# EasyEDA Pro project PCB_keyboard_V1_3_1.eprj

# Schematic PCB_keyboard
Board Name: PCB_keyboard; Create Date: 2025-06-30; Page Name: Sheet_1; Project Name: PCB_keyboard_V1.3; Schematic Name: PCB_keyboard; Update Date: 2025-06-30; Add into BOM: yes; Company: Your Company; Convert to PCB: yes; Date: 2025-05-16; REV: 1.0; Sheet: 1/1; spicePre: .
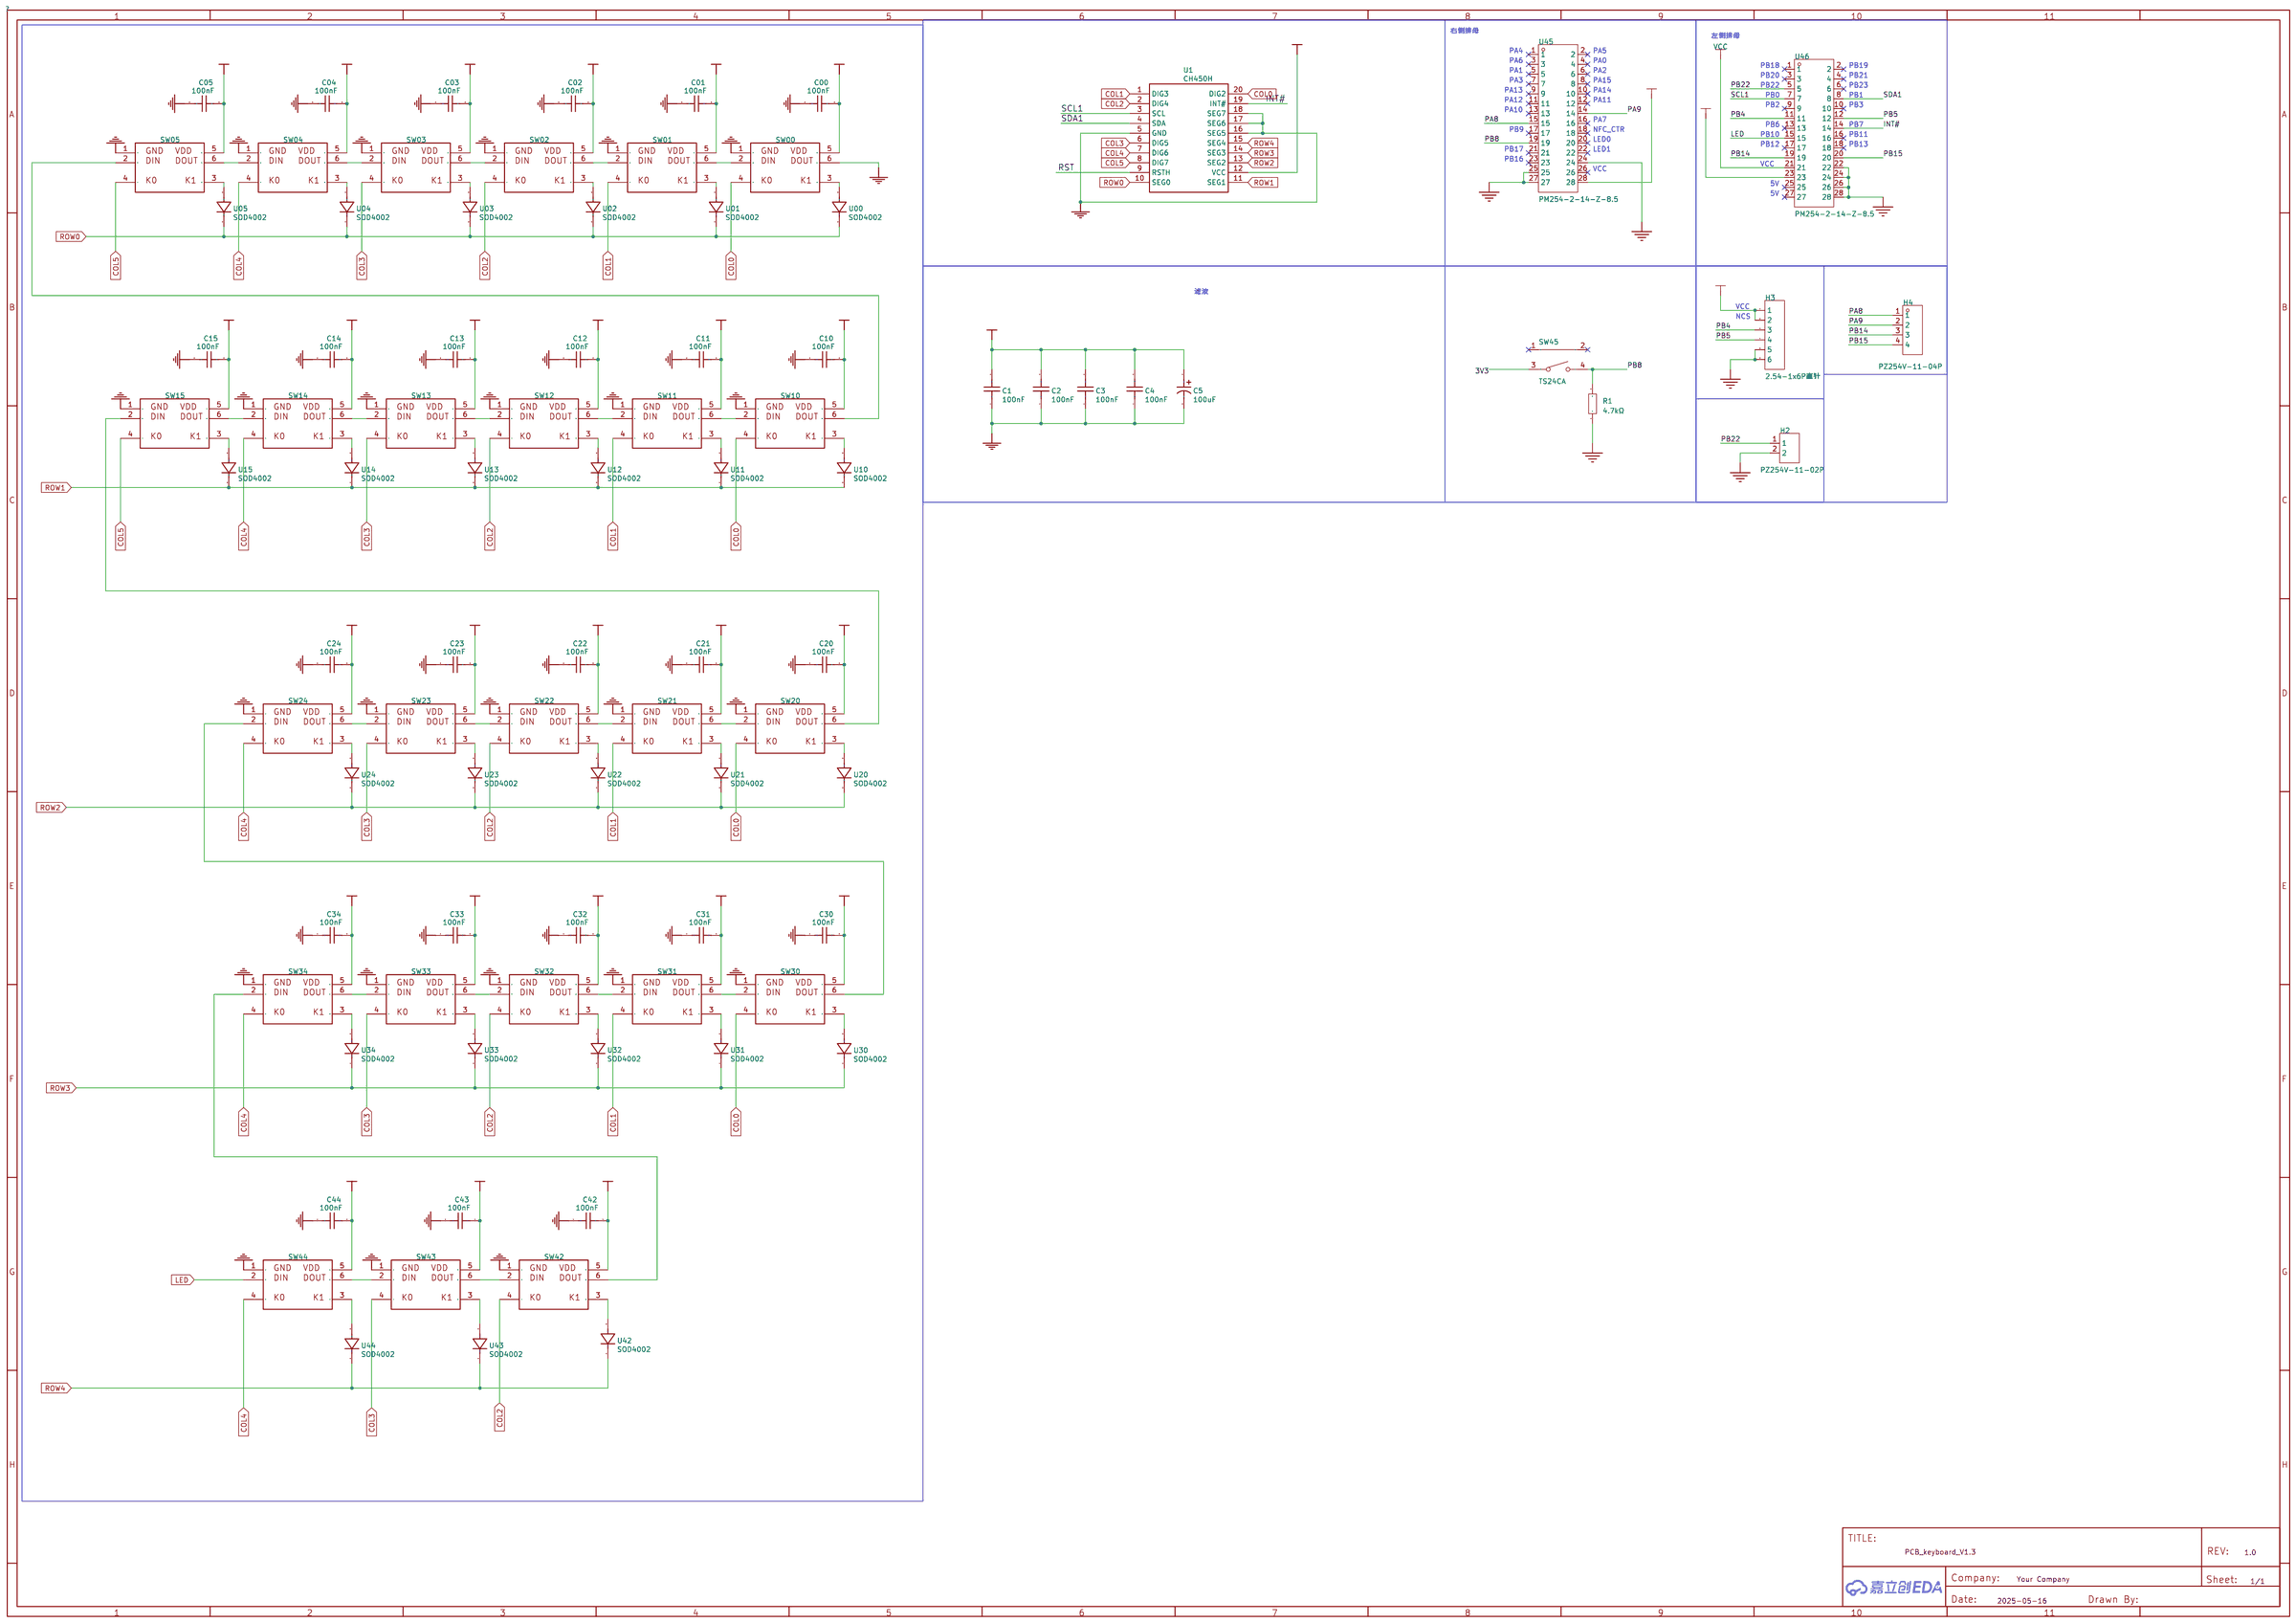
[diagram p0: schematic sheet]

## Parts
C00  100nF  [C0603]
C01  100nF  [C0603]
C1  100nF  [C0603]
C02  100nF  [C0603]
C2  100nF  [C0603]
C03  100nF  [C0603]
C3  100nF  [C0603]
C04  100nF  [C0603]
C4  100nF  [C0603]
C05  100nF  [C0603]
C5  100uF  [CAP-TH_BD6.0-P2.50-D0.5-FD]
C10  100nF  [C0603]
C11  100nF  [C0603]
C12  100nF  [C0603]
C13  100nF  [C0603]
C14  100nF  [C0603]
C15  100nF  [C0603]
C20  100nF  [C0603]
C21  100nF  [C0603]
C22  100nF  [C0603]
C23  100nF  [C0603]
C24  100nF  [C0603]
C30  100nF  [C0603]
C31  100nF  [C0603]
C32  100nF  [C0603]
C33  100nF  [C0603]
C34  100nF  [C0603]
C42  100nF  [C0603]
C43  100nF  [C0603]
C44  100nF  [C0603]
H2  PZ254V-11-02P  [HDR-TH_2P-P2.54-V-M]
H3  2.54-1x6P直针  [HDR-TH_6P-P2.54-V-M-1]
H4  PZ254V-11-04P  [HDR-TH_4P-P2.54-V-M]
R1  4.7kΩ  [R0805]
SW00  凯华轴座+3528反贴灯 COPY  [凯华轴座+3528反贴灯]
SW01  凯华轴座+3528反贴灯 COPY  [凯华轴座+3528反贴灯]
SW02  凯华轴座+3528反贴灯 COPY  [凯华轴座+3528反贴灯]
SW03  凯华轴座+3528反贴灯 COPY  [凯华轴座+3528反贴灯]
SW04  凯华轴座+3528反贴灯 COPY  [凯华轴座+3528反贴灯]
SW05  凯华轴座+3528反贴灯 COPY  [凯华轴座+3528反贴灯]
SW10  凯华轴座+3528反贴灯 COPY  [凯华轴座+3528反贴灯]
SW11  凯华轴座+3528反贴灯 COPY  [凯华轴座+3528反贴灯]
SW12  凯华轴座+3528反贴灯 COPY  [凯华轴座+3528反贴灯]
SW13  凯华轴座+3528反贴灯 COPY  [凯华轴座+3528反贴灯]
SW14  凯华轴座+3528反贴灯 COPY  [凯华轴座+3528反贴灯]
SW15  凯华轴座+3528反贴灯 COPY  [凯华轴座+3528反贴灯]
SW20  凯华轴座+3528反贴灯 COPY  [凯华轴座+3528反贴灯]
SW21  凯华轴座+3528反贴灯 COPY  [凯华轴座+3528反贴灯]
SW22  凯华轴座+3528反贴灯 COPY  [凯华轴座+3528反贴灯]
SW23  凯华轴座+3528反贴灯 COPY  [凯华轴座+3528反贴灯]
SW24  凯华轴座+3528反贴灯 COPY  [凯华轴座+3528反贴灯]
SW30  凯华轴座+3528反贴灯 COPY  [凯华轴座+3528反贴灯]
SW31  凯华轴座+3528反贴灯 COPY  [凯华轴座+3528反贴灯]
SW32  凯华轴座+3528反贴灯 COPY  [凯华轴座+3528反贴灯]
SW33  凯华轴座+3528反贴灯 COPY  [凯华轴座+3528反贴灯]
SW34  凯华轴座+3528反贴灯 COPY  [凯华轴座+3528反贴灯]
SW42  凯华轴座+3528反贴灯 COPY  [凯华轴座+3528反贴灯]
SW43  凯华轴座+3528反贴灯 COPY  [凯华轴座+3528反贴灯]
SW44  凯华轴座+3528反贴灯 COPY  [凯华轴座+3528反贴灯]
SW45  TS24CA  [SW-SMD_TS24CA]
U00  SOD4002  [SOD-123FL_L2.8-W1.8-LS3.8-R-RD]
U1  CH450H  [SOP-20_L12.7-W7.5-P1.27-LS10.3-BL]
U01  SOD4002  [SOD-123FL_L2.8-W1.8-LS3.8-R-RD]
U02  SOD4002  [SOD-123FL_L2.8-W1.8-LS3.8-R-RD]
U03  SOD4002  [SOD-123FL_L2.8-W1.8-LS3.8-R-RD]
U04  SOD4002  [SOD-123FL_L2.8-W1.8-LS3.8-R-RD]
U05  SOD4002  [SOD-123FL_L2.8-W1.8-LS3.8-R-RD]
U10  SOD4002  [SOD-123FL_L2.8-W1.8-LS3.8-R-RD]
U11  SOD4002  [SOD-123FL_L2.8-W1.8-LS3.8-R-RD]
U12  SOD4002  [SOD-123FL_L2.8-W1.8-LS3.8-R-RD]
U13  SOD4002  [SOD-123FL_L2.8-W1.8-LS3.8-R-RD]
U14  SOD4002  [SOD-123FL_L2.8-W1.8-LS3.8-R-RD]
U15  SOD4002  [SOD-123FL_L2.8-W1.8-LS3.8-R-RD]
U20  SOD4002  [SOD-123FL_L2.8-W1.8-LS3.8-R-RD]
U21  SOD4002  [SOD-123FL_L2.8-W1.8-LS3.8-R-RD]
U22  SOD4002  [SOD-123FL_L2.8-W1.8-LS3.8-R-RD]
U23  SOD4002  [SOD-123FL_L2.8-W1.8-LS3.8-R-RD]
U24  SOD4002  [SOD-123FL_L2.8-W1.8-LS3.8-R-RD]
U30  SOD4002  [SOD-123FL_L2.8-W1.8-LS3.8-R-RD]
U31  SOD4002  [SOD-123FL_L2.8-W1.8-LS3.8-R-RD]
U32  SOD4002  [SOD-123FL_L2.8-W1.8-LS3.8-R-RD]
U33  SOD4002  [SOD-123FL_L2.8-W1.8-LS3.8-R-RD]
U34  SOD4002  [SOD-123FL_L2.8-W1.8-LS3.8-R-RD]
U42  SOD4002  [SOD-123FL_L2.8-W1.8-LS3.8-R-RD]
U43  SOD4002  [SOD-123FL_L2.8-W1.8-LS3.8-R-RD]
U44  SOD4002  [SOD-123FL_L2.8-W1.8-LS3.8-R-RD]
U45  PM254-2-14-Z-8.5  [HDR-TH_28P-P2.54-V-F-R2-C14-S2.54-1]
U46  PM254-2-14-Z-8.5  [HDR-TH_28P-P2.54-V-F-R2-C14-S2.54-1]

## Library data of the parts
C00 C01 C1 C02 C2 C03 C3 C04 C4 C05 C10-C15 C20-C24 C30-C34 C42-C44 = 100nF: Supplier: LCSC; Supplier Part: C6119867; Manufacturer: HRE(芯声); Manufacturer Part: CGA0603X7R104K500JT; JLCPCB Part Class: Extended Part; nameAlias: Value; Contributor: lcsc; spicePre: C; spiceSymbolName: CGA0603X7R104K500JT
C5 = 100uF: Supplier: LCSC; Supplier Part: C2873969; Manufacturer: ROQANG(容强); Manufacturer Part: KM1E101M0611; link: https://so.szlcsc.com/global.html?k=C2873969&ref=editor; nameAlias: Value; Contributor: lcsc; spicePre: C; spiceSymbolName: KM1E101M0611
H2 = PZ254V-11-02P: 插针结构:1x2P;间距:2.54mm;行距:-;圆针/方针:方针;安装方式:直插;排数:单排;总PIN位数:2P;额定电流:-;额定电压:-;配合针长度:6mm;塑高:2.5mm;端接针长度:3mm;触头材质:黄铜;触头镀层:-;工作温度:-40℃~+105℃;颜色:黑色;; LCSC Part Name: 1x2P 间距:2.54mm 方针 直插; Supplier Part: C492401; Manufacturer: XFCN(兴飞); Supplier Footprint: 插件,P=2.54mm; JLCPCB Part Class: 扩展库; Datasheet: https://atta.szlcsc.com/upload/public/pdf/source/20200309/C492401_A812433581A9B211A7FFA413ADDFF0E5.pdf; Supplier: LCSC; Pin Structure: 1x2P; Pitch: 2.54mm; Circluar Pins/Square Pins: 方针; Mounting Type: 直插; Number of Rows: 单排; Number of Pins: 2P; Length of Mating Pin: 6mm; Insulation Height: 2.5mm; Length of End Connection Pin: 3mm; Contact Material: 黄铜; Operating Temperature: -40℃~+105℃; Color: 黑色
H3 = 2.54-1x6P直针: 插针结构:1x6P;间距:2.54mm;行距:-;圆针/方针:方针;安装方式:直插;排数:单排;总PIN位数:6P;额定电流:3A;额定电压:-;配合针长度:-;塑高:-;触头材质:黄铜;触头镀层:-;工作温度:-40℃~+105℃;颜色:黑色;; LCSC Part Name: 1x6P 间距:2.54mm 方针 直插; Supplier Part: C37208; Manufacturer: BOOMELE(博穆精密); Supplier Footprint: 插件,P=2.54mm; JLCPCB Part Class: 扩展库; Datasheet: https://atta.szlcsc.com/upload/public/pdf/source/20250115/42A019761A40C8B839643401D8CA5A96.pdf; Supplier: LCSC; Pin Structure: 1x6P; Pitch: 2.54mm; Circluar Pins/Square Pins: 方针; Mounting Type: 直插; Number of Rows: 单排; Number of Pins: 6P; Current Rating: 3A; Contact Material: 黄铜; Operating Temperature: -40℃~+105℃; Color: 黑色
H4 = PZ254V-11-04P: 插针结构:1x4P;间距:2.54mm;行距:-;圆针/方针:方针;安装类型:直插;排数:单排;总PIN位数:4P;额定电流:3A;额定电压:250V;配合针长度:6mm;塑高:2.5mm;端接针长度:3mm;触头材质:-;工作温度范围:-40℃~+105℃;颜色:黑色;; LCSC Part Name: 间距:2.54mm 1x4P 直插 方针; Supplier Part: C2691448; Manufacturer: XFCN(兴飞); Supplier Footprint: 插件,P=2.54mm; JLCPCB Part Class: 扩展库; Datasheet: https://atta.szlcsc.com/upload/public/pdf/source/20200309/C492403_F9F19131791D08044AD4F84F8E751A34.pdf; Supplier: LCSC; Pin Structure: 1x4P; Pitch: 2.54mm; Circluar Pins/Square Pins: 方针; Mounting Type: 直插; Number of Rows: 单排; Number of Pins: 4P; Current Rating (Max): 3A; Voltage Rating (Max): 250V; Length of Mating Pin: 6mm; Insulation Height: 2.5mm; Length of End Connection Pin: 3mm; Operating Temperature Range: -40℃~+105℃; Color: 黑色
R1 = 0805W8F4701T5E: 电阻类型:厚膜电阻;阻值:4.7kΩ;精度:±1%;功率:125mW;最大工作电压:150V;温度系数:±100ppm/℃;; LCSC Part Name: 4.7kΩ ±1% 125mW 厚膜电阻; Supplier Part: C17673; Manufacturer: UNI-ROYAL(厚声); Supplier Footprint: 0805; JLCPCB Part Class: 基础库; Datasheet: https://atta.szlcsc.com/upload/public/pdf/source/20200306/C422600_1E6D84923E4A46A82E41ADD87F860B5C.pdf; Supplier: LCSC; Type: 厚膜电阻; Tolerance: ±1%; Power(Watts): 125mW; Overload Voltage (Max): 150V; Temperature Coefficient: ±100ppm/℃; Operating Temperature Range: -55℃~+155℃
SW00 SW01 SW02 SW03 SW04 SW05 SW10-SW15 SW20-SW24 SW30-SW34 SW42-SW44 = 凯华轴座+3528反贴灯 COPY
SW45 = TS24CA: 电路结构:单刀单掷;按钮形状:矩形按钮;安装方式:卧贴;开关长度:4.55mm;开关宽度:1.8mm;开关高度:3.5mm;触点电流:50mA;额定电压(DC):12V;带灯:-;机械寿命:-;; LCSC Part Name: 4.55*1.8*3.5mm 卧贴 轻触开关; Supplier Part: C393942; Manufacturer: SHOU HAN(首韩); Supplier Footprint: SMD; JLCPCB Part Class: 扩展库; Datasheet: https://atta.szlcsc.com/upload/public/pdf/source/20190521/C393942_591A9E318887EFA4274D34029981AD99.pdf; Supplier: LCSC; Circuit: 单刀单掷; Actuator Style: 矩形按钮; Mounting Style: 卧贴; Switch Length: 4.55mm; Switch Width: 1.8mm; Switch Height: 3.5mm; Contact Current: 50mA; Voltage Rating (DC): 12V
U00 U01 U02 U03 U04 U05 U10-U15 U20-U24 U30-U34 U42-U44 = SOD4002: Supplier: LCSC; Supplier Part: C2994252; Manufacturer: MDD(辰达半导体); JLCPCB Part Class: Extended Part; link: https://so.szlcsc.com/global.html?k=C2994252&ref=editor; Contributor: lcsc; spicePre: U
U1 = CH450H: Supplier: LCSC; Manufacturer: WCH(南京沁恒); Supplier Part: C56245; JLCPCB Part Class: Extended Part; spicePre: U
U45 U46 = PM254-2-14-Z-8.5: 插孔结构:2x14P;间距:2.54mm;行距:2.54mm;圆孔/方孔:方孔;安装类型:直插;排数:双排;总孔位数:28P;额定电流:3A;额定电压:-;插孔方向:顶部;塑高:8.5mm;触头材质:铜合金;工作温度范围:-40℃~+105℃;焊接温度(最大值):260℃@5S;; LCSC Part Name: 2x14P 间距:2.54mm 直插; Supplier Part: C2897415; Manufacturer: HCTL(华灿天禄); Supplier Footprint: 插件,P=2.54mm; JLCPCB Part Class: 扩展库; Datasheet: https://atta.szlcsc.com/upload/public/pdf/source/20230609/3D36CA2C1BFC9FD1C3F709AD9DFEB9C2.pdf; Supplier: LCSC; Holes Structure: 2x14P; Pitch: 2.54mm; Row Spacing: 2.54mm; Circular Hole / Square Hole: 方孔; Mounting Type: 直插; Number of Rows: 双排; Number of Holes: 28P; Current Rating (Max): 3A; Holes Direction: 顶部; Insulation Height: 8.5mm; Contact Material: 铜合金; Operating Temperature Range: -40℃~+105℃; Soldering Temperature(Max): 260℃@5S

## Nets
3V3: H3.1 H3.2 SW45.3 U45.28 U46.23
GND: C00.1 C01.1 C1.1 C02.1 C2.1 C03.1 C3.1 C04.1 C4.1 C05.1 C5.2 C10.1 C11.1 C12.1 C13.1 C14.1 C15.1 C20.1 C21.1 C22.1 C23.1 C24.1 C30.1 C31.1 C32.1 C33.1 C34.1 C42.1 C43.1 C44.1 H2.2 H3.5 H3.6 R1.1 SW00.1 SW00.6 SW01.1 SW02.1 SW03.1 SW04.1 SW05.1 SW10.1 SW11.1 SW12.1 SW13.1 SW14.1 SW15.1 SW20.1 SW21.1 SW22.1 SW23.1 SW24.1 SW30.1 SW31.1 SW32.1 SW33.1 SW34.1 SW42.1 SW43.1 SW44.1 U1.5(GND) U1.16(SEG5) U1.17(SEG6) U1.18(SEG7) U45.24 U45.25 U45.27 U46.22 U46.24 U46.26 U46.28
VCC: C00.2 C01.2 C1.2 C02.2 C2.2 C03.2 C3.2 C04.2 C4.2 C5.1 C05.2 C10.2 C11.2 C12.2 C13.2 C14.2 C15.2 C20.2 C21.2 C22.2 C23.2 C24.2 C30.2 C31.2 C32.2 C33.2 C34.2 C42.2 C43.2 C44.2 SW00.5 SW01.5 SW02.5 SW03.5 SW04.5 SW05.5 SW10.5 SW11.5 SW12.5 SW13.5 SW14.5 SW15.5 SW20.5 SW21.5 SW22.5 SW23.5 SW24.5 SW30.5 SW31.5 SW32.5 SW33.5 SW34.5 SW42.5 SW43.5 SW44.5 U1.12(VCC) U46.21
COL0: SW00.4 SW10.4 SW20.4 SW30.4 U1.20(DIG2)
COL1: SW01.4 SW11.4 SW21.4 SW31.4 U1.1(DIG3)
COL2: SW02.4 SW12.4 SW22.4 SW32.4 SW42.4 U1.2(DIG4)
COL3: SW03.4 SW13.4 SW23.4 SW33.4 SW43.4 U1.6(DIG5)
COL4: SW04.4 SW14.4 SW24.4 SW34.4 SW44.4 U1.7(DIG6)
COL5: SW05.4 SW15.4 U1.8(DIG7)
INT#: U1.19(INT#) U46.14
LED: SW44.2 U46.15
PA8: H4.1 U45.15
PA9: H4.2 U45.14
PB4: H3.3 U46.11
PB5: H3.4 U46.12
PB8: R1.2 SW45.4 U45.19
PB14: H4.3 U46.19
PB15: H4.4 U46.20
PB22: H2.1 U46.5
ROW0: U00.1(K) U01.1(K) U1.10(SEG0) U02.1(K) U03.1(K) U04.1(K) U05.1(K)
ROW1: U1.11(SEG1) U10.1(K) U11.1(K) U12.1(K) U13.1(K) U14.1(K) U15.1(K)
ROW2: U1.13(SEG2) U20.1(K) U21.1(K) U22.1(K) U23.1(K) U24.1(K)
ROW3: U1.14(SEG3) U30.1(K) U31.1(K) U32.1(K) U33.1(K) U34.1(K)
ROW4: U1.15(SEG4) U42.1(K) U43.1(K) U44.1(K)
RST: U1.9(RSTH)
SCL1: U1.3(SCL) U46.7
SDA1: U1.4(SDA) U46.8
$1N69: SW00.3 U00.2(A)
$1N70: SW01.3 U01.2(A)
$1N71: SW02.3 U02.2(A)
$1N72: SW03.3 U03.2(A)
$1N73: SW04.3 U04.2(A)
$1N74: SW05.3 U05.2(A)
$1N77: SW10.3 U10.2(A)
$1N78: SW11.3 U11.2(A)
$1N79: SW12.3 U12.2(A)
$1N80: SW13.3 U13.2(A)
$1N81: SW14.3 U14.2(A)
$1N82: SW15.3 U15.2(A)
$1N83: SW20.3 U20.2(A)
$1N84: SW21.3 U21.2(A)
$1N85: SW22.3 U22.2(A)
$1N86: SW23.3 U23.2(A)
$1N87: SW24.3 U24.2(A)
$1N90: SW30.3 U30.2(A)
$1N91: SW31.3 U31.2(A)
$1N92: SW32.3 U32.2(A)
$1N95: SW33.3 U33.2(A)
$1N97: SW34.3 U34.2(A)
$1N99: SW42.3 U42.2(A)
$1N100: SW43.3 U43.2(A)
$1N101: SW44.3 U44.2(A)
$1N102: SW42.2 SW43.6
$1N103: SW43.2 SW44.6
$1N108: SW34.2 SW42.6
$1N109: SW33.2 SW34.6
$1N110: SW32.2 SW33.6
$1N111: SW31.2 SW32.6
$1N112: SW30.2 SW31.6
$1N113: SW24.2 SW30.6
$1N114: SW23.2 SW24.6
$1N115: SW22.2 SW23.6
$1N116: SW21.2 SW22.6
$1N117: SW20.2 SW21.6
$1N118: SW15.2 SW20.6
$1N119: SW14.2 SW15.6
$1N120: SW13.2 SW14.6
$1N121: SW12.2 SW13.6
$1N122: SW11.2 SW12.6
$1N123: SW10.2 SW11.6
$1N125: SW04.2 SW05.6
$1N126: SW03.2 SW04.6
$1N127: SW02.2 SW03.6
$1N128: SW01.2 SW02.6
$1N129: SW00.2 SW01.6
$1N130: SW05.2 SW10.6

Not connected (* = marked no-connect by the designer): SW45 1* 2*; U45 1* 2* 3* 4* 5* 6* 7* 8* 9* 10* 11* 12* 13* 16* 17* 18* 20* 21* 22* 23* 26*; U46 1* 2* 3* 4* 6* 9* 10* 13* 16* 17* 18* 25* 27*

## Notes on the sheet
- 右侧排母
- 左侧排母
- PA4
- PA5
- PA6
- PA0
- PB18
- PB19
- PA1
- PA3
- PA15
- PA2
- PB20
- PB21
- PA13
- PA14
- PB22
- PB23
- PA12
- PA11
- PB0
- PB2
- PB1
- PB3
- PA10
- PA7
- PB6
- PB7
- PB9
- LED0
- NFC_CTR
- PB10
- PB11
- PB17
- LED1
- PB12
- PB13
- PB16
- VCC
- VCC
- 5V
- 5V
- 滤波
- VCC
- NCS

# Board PCB_PCB_keyboard
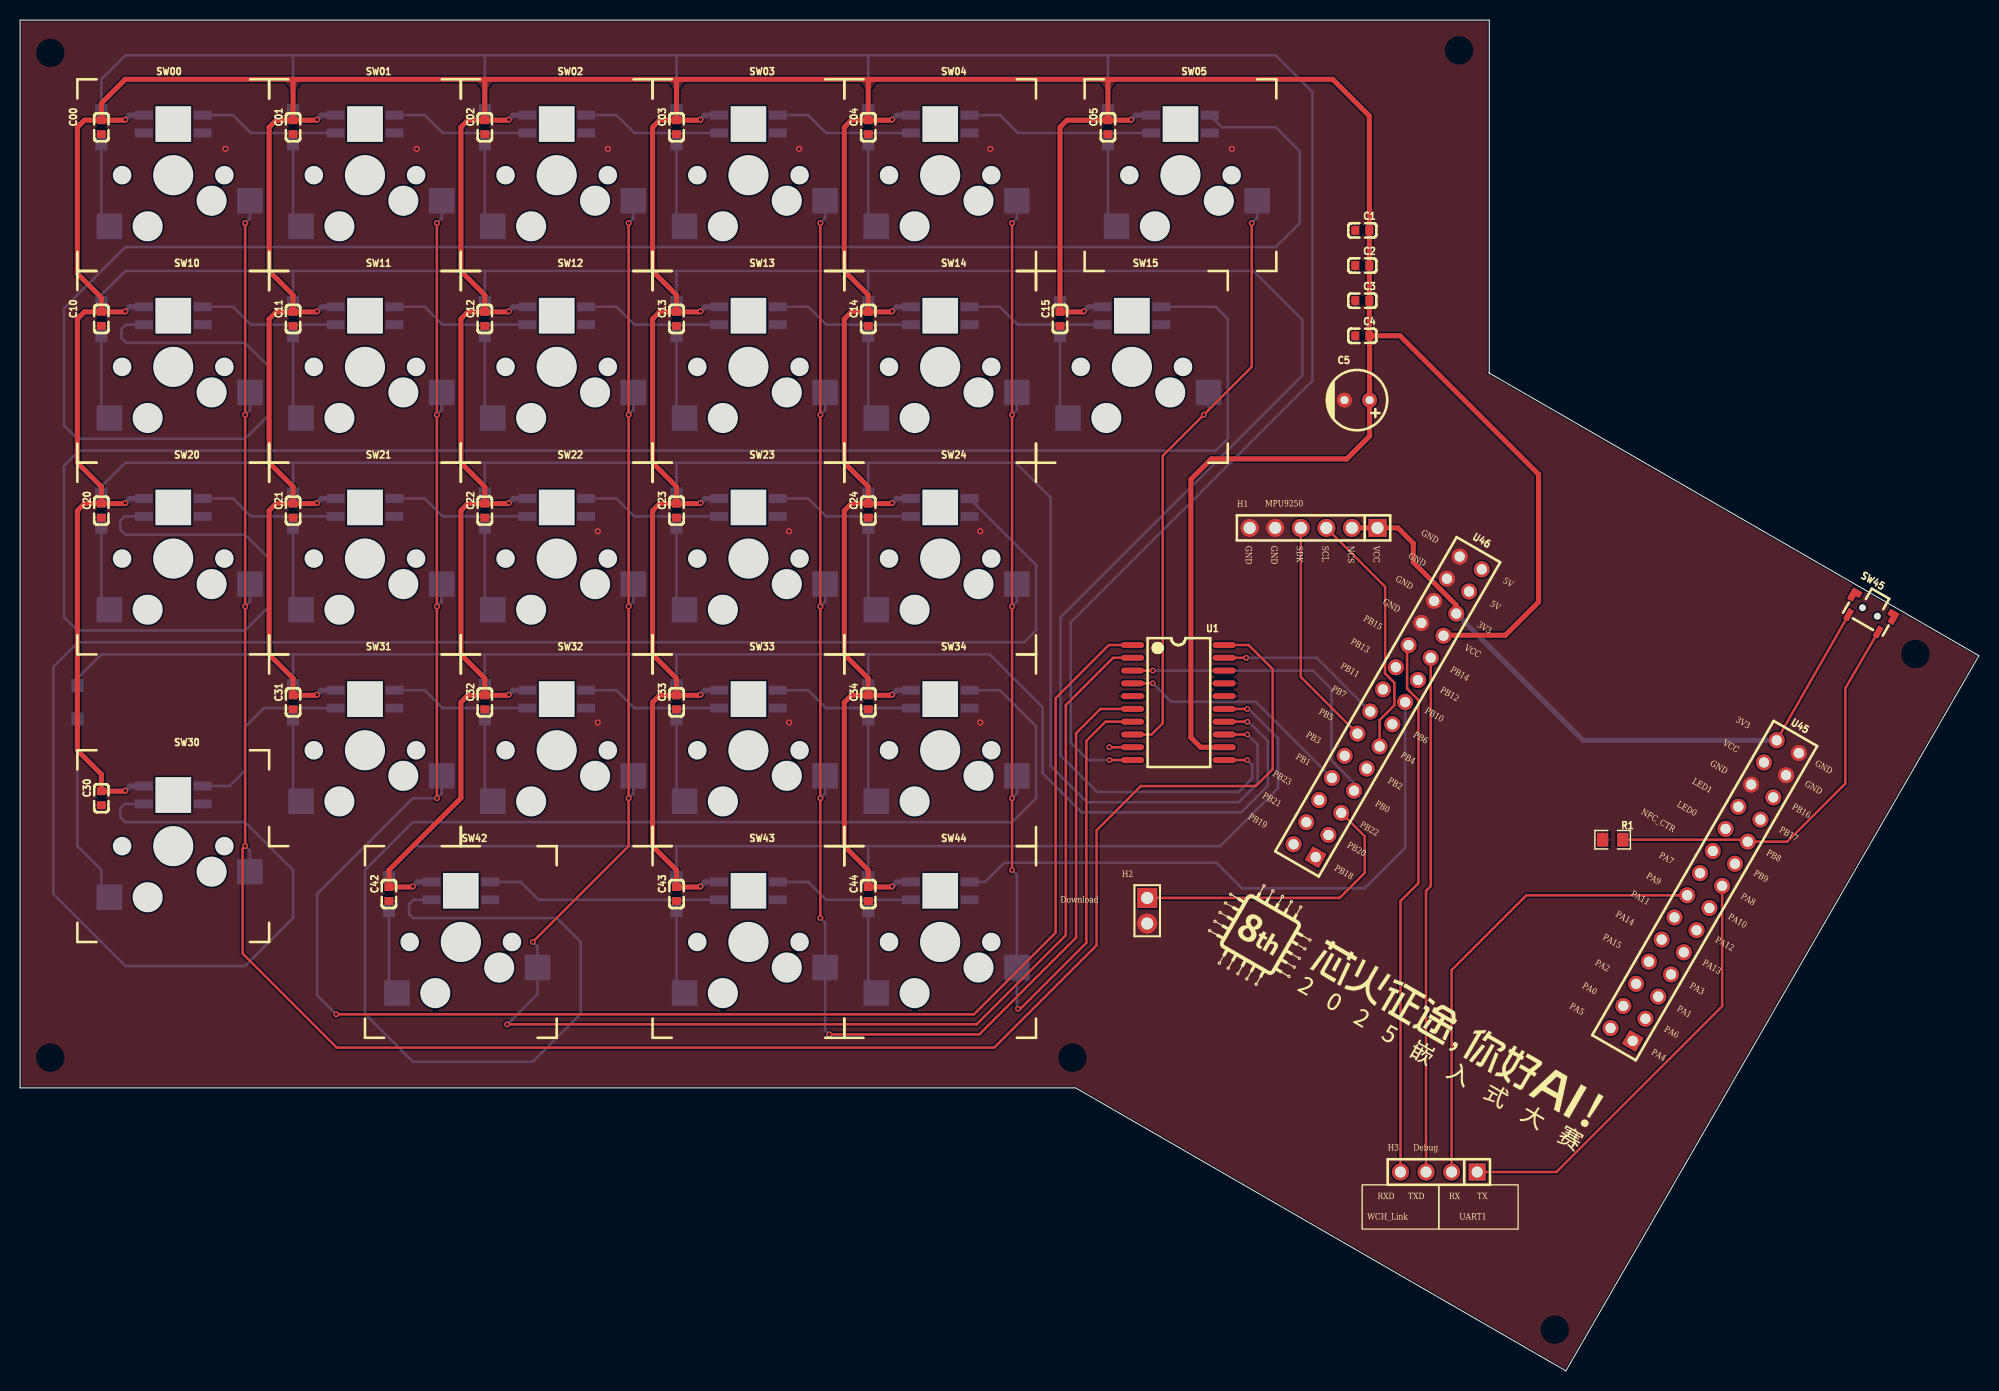
[diagram p1: board, top side]
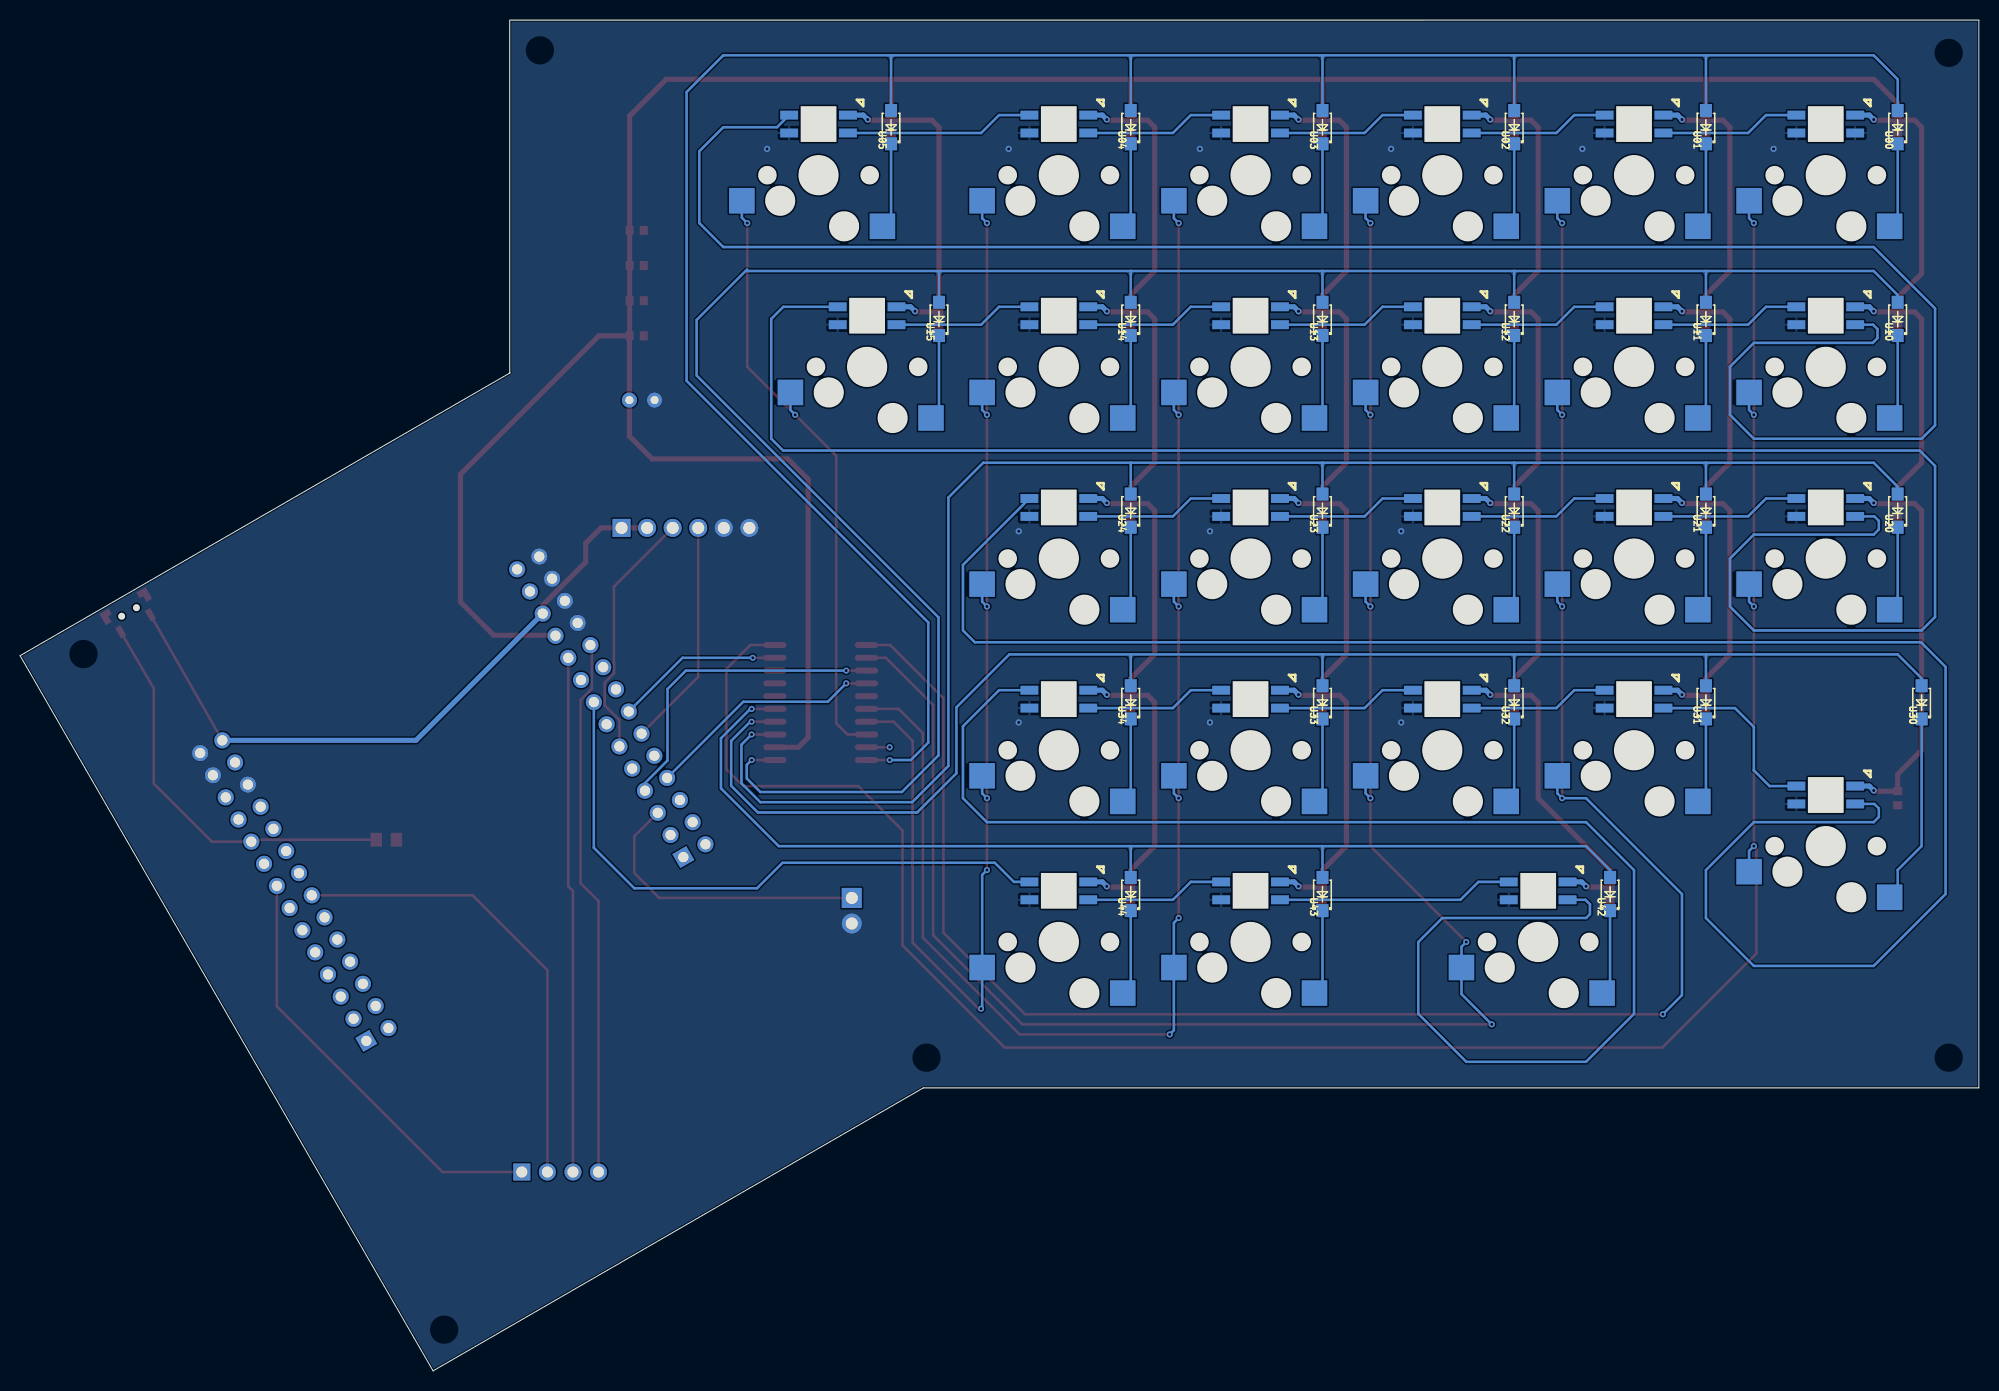
[diagram p2: board, bottom side, seen from below]

Outline 194.62 x 134.23 mm; copper layers: Top Layer, Bottom Layer. Coordinates in mm from the lower left corner of the outline.
Outline path: 145.97,99.15 145.9,99.19 ; 145.97,99.15 145.97,134.23 0,134.23 0,28.12 104.87,28.12 153.58,0 194.62,71.07 145.97,99.15
Stack: Top Layer 0.035mm / Dielectric1 1.51mm FR4 er 4.5 / Bottom Layer 0.035mm

## Design rules (mm)
spacing Default (default): track to track 0.152, other pairs 0 to 0.152
track width Default (default): min 0.254, default 0.254, max 25.4
differential pair differentialPair (default): width min 0.127, default 0.254, max 2.54; gap min 0.152, default 0.152
via Default (default): diameter min 0.61, default 0.61, max 100.025; hole min 0.305, default 0.305, max 59.995

## Placement (name value [footprint] x y rotation side)
C00  100nF  [C0603]  8.07 123.59 90 top
C01  100nF  [C0603]  27.12 123.59 90 top
C1  100nF  [C0603]  133.36 113.34 0 top
C02  100nF  [C0603]  46.17 123.59 90 top
C2  100nF  [C0603]  133.36 109.84 0 top
C03  100nF  [C0603]  65.22 123.59 90 top
C3  100nF  [C0603]  133.36 106.35 0 top
C04  100nF  [C0603]  84.27 123.59 90 top
C4  100nF  [C0603]  133.36 102.86 0 top
C05  100nF  [C0603]  108.08 123.59 90 top
C5  100uF  [CAP-TH_BD6.0-P2.50-D0.5-FD]  132.83 96.47 180 top
C10  100nF  [C0603]  8.07 104.54 90 top
C11  100nF  [C0603]  27.12 104.54 90 top
C12  100nF  [C0603]  46.17 104.54 90 top
C13  100nF  [C0603]  65.22 104.54 90 top
C14  100nF  [C0603]  84.27 104.54 90 top
C15  100nF  [C0603]  103.32 104.54 90 top
C20  100nF  [C0603]  8.07 85.49 90 top
C21  100nF  [C0603]  27.12 85.49 90 top
C22  100nF  [C0603]  46.17 85.49 90 top
C23  100nF  [C0603]  65.22 85.49 90 top
C24  100nF  [C0603]  84.27 85.49 90 top
C30  100nF  [C0603]  8.07 56.91 90 top
C31  100nF  [C0603]  27.12 66.43 90 top
C32  100nF  [C0603]  46.17 66.43 90 top
C33  100nF  [C0603]  65.22 66.43 90 top
C34  100nF  [C0603]  84.27 66.43 90 top
C42  100nF  [C0603]  36.64 47.38 90 top
C43  100nF  [C0603]  65.22 47.38 90 top
C44  100nF  [C0603]  84.27 47.38 90 top
H2  PZ254V-11-02P  [HDR-TH_2P-P2.54-V-M]  111.98 45.73 270 top
H3  2.54-1x6P直针  [HDR-TH_6P-P2.54-V-M-1]  128.51 83.77 180 top
H4  PZ254V-11-04P  [HDR-TH_4P-P2.54-V-M]  140.96 19.76 180 top
R1  4.7kΩ  [R0805]  158.23 52.78 0 top
SW00  凯华轴座+3528反贴灯 COPY  [凯华轴座+3528反贴灯]  15.21 118.82 0 top
SW01  凯华轴座+3528反贴灯 COPY  [凯华轴座+3528反贴灯]  34.26 118.82 0 top
SW02  凯华轴座+3528反贴灯 COPY  [凯华轴座+3528反贴灯]  53.31 118.82 0 top
SW03  凯华轴座+3528反贴灯 COPY  [凯华轴座+3528反贴灯]  72.36 118.82 0 top
SW04  凯华轴座+3528反贴灯 COPY  [凯华轴座+3528反贴灯]  91.41 118.82 0 top
SW05  凯华轴座+3528反贴灯 COPY  [凯华轴座+3528反贴灯]  115.29 118.82 0 top
SW10  凯华轴座+3528反贴灯 COPY  [凯华轴座+3528反贴灯]  15.21 99.77 0 top
SW11  凯华轴座+3528反贴灯 COPY  [凯华轴座+3528反贴灯]  34.26 99.77 0 top
SW12  凯华轴座+3528反贴灯 COPY  [凯华轴座+3528反贴灯]  53.31 99.77 0 top
SW13  凯华轴座+3528反贴灯 COPY  [凯华轴座+3528反贴灯]  72.36 99.77 0 top
SW14  凯华轴座+3528反贴灯 COPY  [凯华轴座+3528反贴灯]  91.41 99.77 0 top
SW15  凯华轴座+3528反贴灯 COPY  [凯华轴座+3528反贴灯]  110.46 99.77 0 top
SW20  凯华轴座+3528反贴灯 COPY  [凯华轴座+3528反贴灯]  15.21 80.72 0 top
SW21  凯华轴座+3528反贴灯 COPY  [凯华轴座+3528反贴灯]  34.26 80.72 0 top
SW22  凯华轴座+3528反贴灯 COPY  [凯华轴座+3528反贴灯]  53.31 80.72 0 top
SW23  凯华轴座+3528反贴灯 COPY  [凯华轴座+3528反贴灯]  72.36 80.72 0 top
SW24  凯华轴座+3528反贴灯 COPY  [凯华轴座+3528反贴灯]  91.41 80.72 0 top
SW30  凯华轴座+3528反贴灯 COPY  [凯华轴座+3528反贴灯]  15.21 52.15 0 top
SW31  凯华轴座+3528反贴灯 COPY  [凯华轴座+3528反贴灯]  34.26 61.67 0 top
SW32  凯华轴座+3528反贴灯 COPY  [凯华轴座+3528反贴灯]  53.31 61.67 0 top
SW33  凯华轴座+3528反贴灯 COPY  [凯华轴座+3528反贴灯]  72.36 61.67 0 top
SW34  凯华轴座+3528反贴灯 COPY  [凯华轴座+3528反贴灯]  91.41 61.67 0 top
SW42  凯华轴座+3528反贴灯 COPY  [凯华轴座+3528反贴灯]  43.79 42.62 0 top
SW43  凯华轴座+3528反贴灯 COPY  [凯华轴座+3528反贴灯]  72.36 42.62 0 top
SW44  凯华轴座+3528反贴灯 COPY  [凯华轴座+3528反贴灯]  91.41 42.62 0 top
SW45  TS24CA  [SW-SMD_TS24CA]  183.63 75.13 330 top
U00  SOD4002  [SOD-123FL_L2.8-W1.8-LS3.8-R-RD]  8.07 123.59 90 bottom
U1  CH450H  [SOP-20_L12.7-W7.5-P1.27-LS10.3-BL]  115.08 66.42 270 top
U01  SOD4002  [SOD-123FL_L2.8-W1.8-LS3.8-R-RD]  27.12 123.59 90 bottom
U02  SOD4002  [SOD-123FL_L2.8-W1.8-LS3.8-R-RD]  46.17 123.59 90 bottom
U03  SOD4002  [SOD-123FL_L2.8-W1.8-LS3.8-R-RD]  65.22 123.59 90 bottom
U04  SOD4002  [SOD-123FL_L2.8-W1.8-LS3.8-R-RD]  84.27 123.59 90 bottom
U05  SOD4002  [SOD-123FL_L2.8-W1.8-LS3.8-R-RD]  108.08 123.59 90 bottom
U10  SOD4002  [SOD-123FL_L2.8-W1.8-LS3.8-R-RD]  8.07 104.54 90 bottom
U11  SOD4002  [SOD-123FL_L2.8-W1.8-LS3.8-R-RD]  27.12 104.54 90 bottom
U12  SOD4002  [SOD-123FL_L2.8-W1.8-LS3.8-R-RD]  46.17 104.54 90 bottom
U13  SOD4002  [SOD-123FL_L2.8-W1.8-LS3.8-R-RD]  65.22 104.54 90 bottom
U14  SOD4002  [SOD-123FL_L2.8-W1.8-LS3.8-R-RD]  84.27 104.54 90 bottom
U15  SOD4002  [SOD-123FL_L2.8-W1.8-LS3.8-R-RD]  103.32 104.54 90 bottom
U20  SOD4002  [SOD-123FL_L2.8-W1.8-LS3.8-R-RD]  8.07 85.49 90 bottom
U21  SOD4002  [SOD-123FL_L2.8-W1.8-LS3.8-R-RD]  27.12 85.49 90 bottom
U22  SOD4002  [SOD-123FL_L2.8-W1.8-LS3.8-R-RD]  46.17 85.49 90 bottom
U23  SOD4002  [SOD-123FL_L2.8-W1.8-LS3.8-R-RD]  65.22 85.49 90 bottom
U24  SOD4002  [SOD-123FL_L2.8-W1.8-LS3.8-R-RD]  84.27 85.49 90 bottom
U30  SOD4002  [SOD-123FL_L2.8-W1.8-LS3.8-R-RD]  5.69 66.43 90 bottom
U31  SOD4002  [SOD-123FL_L2.8-W1.8-LS3.8-R-RD]  27.12 66.43 90 bottom
U32  SOD4002  [SOD-123FL_L2.8-W1.8-LS3.8-R-RD]  46.17 66.43 90 bottom
U33  SOD4002  [SOD-123FL_L2.8-W1.8-LS3.8-R-RD]  65.22 66.43 90 bottom
U34  SOD4002  [SOD-123FL_L2.8-W1.8-LS3.8-R-RD]  84.27 66.43 90 bottom
U42  SOD4002  [SOD-123FL_L2.8-W1.8-LS3.8-R-RD]  36.64 47.38 90 bottom
U43  SOD4002  [SOD-123FL_L2.8-W1.8-LS3.8-R-RD]  65.22 47.38 90 bottom
U44  SOD4002  [SOD-123FL_L2.8-W1.8-LS3.8-R-RD]  84.27 47.38 90 bottom
U45  PM254-2-14-Z-8.5  [HDR-TH_28P-P2.54-V-F-R2-C14-S2.54-1]  167.37 47.73 60 top
U46  PM254-2-14-Z-8.5  [HDR-TH_28P-P2.54-V-F-R2-C14-S2.54-1]  135.88 65.99 60 top

## Footprints (pads in the part's own frame, mm; a bottom-side part is the same pattern mirrored in y, then rotated)
C0603
  rect 0.8x0.9 smd: 1(-0.7,0) 2(0.7,0)
CAP-TH_BD6.0-P2.50-D0.5-FD
  round 1.5 hole 0.8: 1(-1.25,0) 2(1.25,0)
HDR-TH_2P-P2.54-V-M
  rect 2x2 hole 1.2: 1(-1.27,0)
  round 2 hole 1.2: 2(1.27,0)
HDR-TH_4P-P2.54-V-M
  rect 1.7x1.7 hole 1.1: 1(-3.81,0)
  round 1.7 hole 1.1: 2(-1.27,0) 3(1.27,0) 4(3.81,0)
HDR-TH_6P-P2.54-V-M-1
  rect 1.8x1.8 hole 1.2: 1(-6.35,0)
  round 1.8 hole 1.2: 2(-3.81,0) 3(-1.27,0) 4(1.27,0) 5(3.81,0) 6(6.35,0)
HDR-TH_28P-P2.54-V-F-R2-C14-S2.54-1
  rect 1.6x1.6 hole 1.02: 1(-16.51,-1.27)
  round 1.6 hole 1.02: 2(-16.51,1.27) 3(-13.97,-1.27) 4(-13.97,1.27) 5(-11.43,-1.27) 6(-11.43,1.27) 7(-8.89,-1.27) 8(-8.89,1.27) 9(-6.35,-1.27) 10(-6.35,1.27) 11(-3.81,-1.27) 12(-3.81,1.27) 13(-1.27,-1.27) 14(-1.27,1.27) 15(1.27,-1.27) 16(1.27,1.27) 17(3.81,-1.27) 18(3.81,1.27) 19(6.35,-1.27) 20(6.35,1.27) 21(8.89,-1.27) 22(8.89,1.27) 23(11.43,-1.27) 24(11.43,1.27) 25(13.97,-1.27) 26(13.97,1.27) 27(16.51,-1.27) 28(16.51,1.27)
R0805
  rect 1.133x1.377 smd: 1(-1,0) 2(1,0)
SOD-123FL_L2.8-W1.8-LS3.8-R-RD
  rect 1.3x1.2 smd: 1(1.65,0) 2(-1.65,0)
SOP-20_L12.7-W7.5-P1.27-LS10.3-BL
  oval 0.6x2.3 smd: 1(-5.715,-4.55) 2(-4.445,-4.55) 3(-3.175,-4.55) 4(-1.905,-4.55) 5(-0.635,-4.55) 6(0.635,-4.55) 7(1.905,-4.55) 8(3.175,-4.55) 9(4.445,-4.55) 10(5.715,-4.55) 11(5.715,4.55) 12(4.445,4.55) 13(3.175,4.55) 14(1.905,4.55) 15(0.635,4.55) 16(-0.635,4.55) 17(-1.905,4.55) 18(-3.175,4.55) 19(-4.445,4.55) 20(-5.715,4.55)
SW-SMD_TS24CA
  custom 1.05x1.3 smd: 1(-2.125,0.975) 2(2.125,0.975)
  rect 0.6x1.2 smd: 3(-1.7,-0.975) 4(1.7,-0.975)
凯华轴座+3528反贴灯
  rect 1.778x0.889 smd far side: 1(2.921,4.191) 2(2.921,5.969) 5(-2.921,5.969) 6(-2.921,4.191)
  rect 2.54x2.54 smd far side: 3(-6.35,-5.08) 4(7.62,-2.54)

## Nets
As in the schematic.

Pads without a net: SW45 1 2; U45 1 2 3 4 5 6 7 8 9 10 11 12 13 16 17 18 20 21 22 23 26; U46 1 2 3 4 6 9 10 13 16 17 18 25 27

## Via types
v1: diameter 0.62, hole 0.31, Top Layer to Bottom Layer, 66 vias
v2: diameter 0.61, hole 0.305, Top Layer to Bottom Layer, 9 vias

## Routing (per net, layer and track width the routed paths; a pad name or vN(x,y) marks a point on that pad's centre or on a via; arc(x,y) is an arc through that point)
3V3: length 66.9
  Top Layer w0.254: SW45.3 174.53,62.66
  Top Layer w0.508: H3.2 H3.1 136.89,83.77 138.42,82.24 138.42,80.36 142.69,76.09 U46.23
  Bottom Layer w0.508: 174.53,62.66 155.29,62.66 U46.23
GND:
  vias: v1(20.4,121.43) v1(39.4,121.43) v1(57.4,83.43) v1(57.4,64.43) v1(58.4,121.43) v1(76.4,83.43) v1(76.4,64.43) v1(77.4,121.43) v1(95.4,83.43) v1(95.4,64.43) v1(96.4,121.43) v1(120.4,121.43)
VCC: length 819.2
  Top Layer w0.508: C05.2 108.08,128.32 108.11,128.35 ; C05.2 104.02,124.29 103.32,123.59 C15.2 105.64,105.24 v1(105.7,105.3) ; C05.2 110.34,124.29 v1(110.4,124.35) ; C12.2 48.49,105.24 v1(48.55,105.3) ; C12.2 46.17,106.92 43.79,109.3 43.79,123.59 44.49,124.29 C02.2 ; C12.2 44.49,105.24 43.79,104.54 43.79,90.25 46.17,87.87 C22.2 ; v1(39.02,48.15) 38.96,48.08 C42.2 36.64,49.77 43.79,56.91 43.79,66.43 44.49,67.13 C32.2 ; v1(67.6,105.3) 67.54,105.24 65.22,105.24 ; v1(10.45,105.3) 10.39,105.24 C10.2 ; C22.2 48.49,86.19 v1(48.55,86.25) ; C22.2 44.49,86.19 43.79,85.49 43.79,71.2 46.17,68.82 C32.2 ; C32.2 48.49,67.13 v1(48.55,67.2) ; v1(67.6,124.35) 67.54,124.29 65.22,124.29 ; v1(29.5,124.35) 29.44,124.29 C01.2 ; C02.2 46.17,128.35 ; C02.2 48.49,124.29 v1(48.55,124.35) ; 46.17,128.35 27.12,128.35 ; 46.17,128.35 65.22,128.35 ; 141.42,73.05 141.47,73.1 147.56,73.1 150.86,76.4 150.86,89.1 137.11,102.86 134.06,102.86 ; 65.22,67.13 65.22,68.82 62.84,71.2 62.84,85.49 63.54,86.19 65.22,86.19 ; 65.22,67.13 63.54,67.13 62.84,66.43 62.84,52.15 65.22,49.77 65.22,48.08 67.54,48.08 v1(67.6,48.15) ; 65.22,67.13 67.54,67.13 v1(67.6,67.2) ; 27.12,128.35 10.45,128.35 8.07,125.97 C00.2 ; 27.12,128.35 C01.2 ; C11.2 27.12,106.92 24.74,109.3 24.74,123.59 25.44,124.29 C01.2 ; C11.2 25.44,105.24 24.74,104.54 24.74,90.25 27.12,87.87 C21.2 ; C11.2 29.44,105.24 v1(29.5,105.3) ; C20.2 6.39,86.19 5.69,85.48 5.69,61.67 8.07,59.29 C30.2 10.39,57.61 v1(10.45,57.67) ; C20.2 8.07,87.87 5.69,90.25 5.69,104.53 6.39,105.24 C10.2 ; C20.2 10.39,86.19 v1(10.45,86.25) ; C34.2 82.59,67.13 81.89,66.43 81.89,52.15 84.27,49.77 C44.2 86.59,48.08 v1(86.65,48.15) ; C34.2 86.59,67.13 v1(86.65,67.2) ; C34.2 84.27,68.82 81.89,71.2 81.89,85.49 82.59,86.19 C24.2 ; C04.2 82.59,124.29 81.89,123.59 81.89,109.3 84.27,106.92 C14.2 ; C04.2 86.59,124.29 v1(86.65,124.35) ; C04.2 84.27,128.35 ; 108.11,128.35 84.27,128.35 ; 108.11,128.35 130.41,128.35 134.06,124.71 C1.2 C2.2 C3.2 134.06,102.86 ; 65.22,86.19 67.54,86.19 v1(67.6,86.25) ; 65.22,86.19 65.22,87.87 62.84,90.25 62.84,104.54 63.54,105.24 65.22,105.24 ; 65.22,124.29 63.54,124.29 62.84,123.59 62.84,109.3 65.22,106.92 65.22,105.24 ; 65.22,124.29 65.22,128.35 ; C00.2 10.39,124.29 v1(10.45,124.35) ; C00.2 6.39,124.29 5.69,123.58 5.69,109.04 8.07,106.66 C10.2 ; v1(86.65,86.25) 86.59,86.19 C24.2 ; 119.63,61.97 117.29,61.97 116.32,62.94 116.32,88.59 118.35,90.63 131.81,90.63 134.08,92.89 C5.1 134.08,102.83 134.06,102.86 ; C21.2 25.44,86.19 24.74,85.49 24.74,71.2 27.12,68.82 C31.2 29.44,67.13 v1(29.5,67.2) ; C21.2 29.44,86.19 v1(29.5,86.25) ; 65.22,128.35 84.27,128.35 ; C14.2 82.59,105.24 81.89,104.54 81.89,90.25 84.27,87.87 C24.2 ; C14.2 86.59,105.24 v1(86.65,105.3)
  Bottom Layer w0.508: SW02.5 48.99,124.79 v1(48.55,124.35) ; 69.44,86.69 68.04,86.69 v1(67.6,86.25) ; v1(67.6,48.15) 68.04,48.59 SW43.5 ; SW01.5 29.94,124.79 v1(29.5,124.35) ; v1(67.6,124.35) 68.04,124.79 SW03.5 ; v1(86.65,105.3) 87.09,105.74 SW14.5 ; SW42.5 39.47,48.59 v1(39.02,48.15) ; v1(10.45,86.25) 10.89,86.69 12.29,86.69 ; 50.39,86.69 48.99,86.69 v1(48.55,86.25) ; v1(86.65,48.15) 87.09,48.59 SW44.5 ; SW05.5 110.84,124.79 v1(110.4,124.35) ; v1(10.45,124.35) 10.89,124.79 SW00.5 ; v1(29.5,105.3) 29.94,105.74 SW11.5 ; SW04.5 87.09,124.79 v1(86.65,124.35) ; v1(86.65,86.25) 87.09,86.69 88.49,86.69 ; SW10.5 10.89,105.74 v1(10.45,105.3) ; v1(67.6,105.3) 68.04,105.74 SW13.5 ; SW31.5 29.94,67.64 v1(29.5,67.2) ; SW30.5 10.89,58.12 v1(10.45,57.67) ; v1(29.5,86.25) 29.94,86.69 31.34,86.69 ; SW15.5 106.14,105.74 v1(105.7,105.3) ; SW32.5 48.99,67.64 v1(48.55,67.2) ; v1(86.65,67.2) 87.09,67.64 SW34.5 ; v1(67.6,67.2) 68.04,67.64 SW33.5 ; v1(48.55,105.3) 48.99,105.74 SW12.5
COL0: length 222.8
  Top Layer w0.254: U1.20 122.06,72.13 124.45,69.75 124.45,59.78 122.78,58.11 111.35,58.11 106.95,53.72 106.95,42.29 96.79,32.13 31.45,32.13 22.1,41.48 22.1,51.89 v1(22.36,52.15) v1(22.36,75.96) v1(22.36,95.01) v1(22.36,114.06)
  Bottom Layer w0.254: v1(22.36,75.96) 22.83,76.44 SW20.4 ; SW00.4 22.83,114.54 v1(22.36,114.06) ; v1(22.36,95.01) 22.83,95.49 SW10.4 ; v1(22.36,52.15) 22.83,51.67 SW30.4
COL1: length 203.4
  Top Layer w0.254: v1(41.41,114.06) v1(41.41,95.01) v1(41.41,75.96) v1(41.41,56.91) ; 31.4,35.43 94.76,35.43 102.89,43.56 102.89,66.85 108.17,72.13 U1.1
  Bottom Layer w0.254: v1(41.41,75.96) 41.88,76.44 SW21.4 ; v1(41.41,114.06) 41.88,114.54 SW01.4 ; SW11.4 41.88,95.49 v1(41.41,95.01) ; v1(31.4,35.43) 29.5,37.33 29.5,47.38 39.02,56.91 v1(41.41,56.91) 41.88,57.39 SW31.4
COL2: length 185.3
  Top Layer w0.254: v1(60.46,114.06) v1(60.46,95.01) v1(60.46,75.96) v1(60.46,56.91) 60.46,52.15 v1(50.93,42.62) ; U1.2 108.6,70.86 103.9,66.16 103.9,43.3 95.03,34.44 v1(48.4,34.44)
  Bottom Layer w0.254: SW12.4 60.93,95.49 v1(60.46,95.01) ; v1(60.46,114.06) 60.93,114.54 SW02.4 ; v1(60.46,56.91) 60.93,57.39 SW32.4 ; v1(48.4,34.43) 51.41,37.44 SW42.4 51.41,42.15 v1(50.93,42.62) ; v1(60.46,75.96) 60.93,76.44 SW22.4
COL3: length 146.1
  Top Layer w0.254: v1(80.4,33.44) 95.3,33.44 104.92,43.05 104.92,63.37 107.33,65.78 U1.6 ; v1(79.51,114.06) v1(79.51,95.01) v1(79.51,75.96) v1(79.51,56.91) v1(79.51,45)
  Bottom Layer w0.254: v1(79.51,75.96) 79.98,76.44 SW23.4 ; SW03.4 79.98,114.54 v1(79.51,114.06) ; v1(79.51,56.91) 79.98,57.39 SW33.4 ; v1(79.51,95.01) 79.98,95.49 SW13.4 ; v1(80.4,33.43) 79.98,33.85 SW43.4 79.98,44.53 v1(79.51,45)
COL4: length 122.9
  Top Layer w0.254: U1.7 107.84,64.51 105.93,62.61 105.93,42.54 99.38,35.99 99.15,35.99 ; v1(98.56,49.77) v1(98.56,56.91) v1(98.56,75.96) v1(98.56,95.01) v1(98.56,114.06)
  Bottom Layer w0.254: SW04.4 99.03,114.54 v1(98.56,114.06) ; v1(98.56,49.77) 99.03,49.29 SW44.4 99.03,36.1 v1(99.15,35.99) ; SW24.4 99.03,76.44 v1(98.56,75.96) ; SW14.4 99.03,95.49 v1(98.56,95.01) ; v1(98.56,56.91) 99.03,57.39 SW34.4
COL5: length 61.7
  Top Layer w0.254: U1.8 112.41,63.24 113.53,64.36 113.53,90.93 v1(117.61,95.01) 122.37,99.77 v1(122.37,114.06)
  Bottom Layer w0.254: v1(117.61,95.01) 118.08,95.49 SW15.4 ; SW05.4 122.91,114.6 v1(122.37,114.06)
INT#: length 16.7
  Top Layer w0.254: v2(121.82,70.86) U1.19
  Bottom Layer w0.254: v2(121.82,70.86) 128.81,70.86 U46.14
LED: length 61.3
  Bottom Layer w0.254: U46.15 137.61,51.98 133.59,47.95 121.4,47.95 118.86,50.49 97.78,50.49 95.87,48.59 SW44.2
PA8: length 43.1
  Top Layer w0.254: H4.1 152.64,19.76 169.11,36.23 U45.15
PA9: length 46.6
  Top Layer w0.254: U45.14 149.66,47.26 142.23,39.83 H4.2
PB4: length 25.1
  Top Layer w0.254: U46.11 135.07,64.68 136.53,66.14 136.53,68.38 135.6,69.31 135.6,70.37 135.62,70.39 135.62,77.93 H3.3
PB5: length 22.8
  Top Layer w0.254: 132.87,63.32 127.24,68.96 H3.4
PB8: length 40.5
  Top Layer w0.254: SW45.4 181.34,67.83 181.34,58.37 175.57,52.59 U45.19 171.46,52.78 R1.2
PB14: length 51.3
  Top Layer w0.254: H4.3 139.69,47.7 140.15,48.17 140.15,70.85
PB15: length 53.6
  Top Layer w0.254: 137.95,72.12 137.8,71.97 137.8,67.79 138.93,66.67 138.93,48.46 137.15,46.68 H4.4
PB22: length 29.6
  Top Layer w0.254: H2.1 131.11,47 133.59,49.48 133.59,53.13 131.26,55.45
ROW0: length 234.9
  Top Layer w0.254: U1.10 v2(108.22,60.7)
  Bottom Layer w0.254: 27.12,130.73 10.45,130.73 8.07,128.35 U00.1 ; 27.12,130.73 46.17,130.73 ; 27.12,130.73 U01.1 ; 108.08,130.73 84.27,130.73 ; 108.08,130.73 U05.1 ; 108.08,130.73 124.75,130.73 128.4,127.08 128.4,98.39 104.38,74.37 104.38,62.43 106.11,60.7 v2(108.22,60.7) ; 84.27,130.73 U04.1 ; 84.27,130.73 65.22,130.73 ; U03.1 65.22,130.73 ; 65.22,130.73 46.17,130.73 ; 46.17,130.73 U02.1
ROW1: length 217.3
  Top Layer w0.254: U1.11 v2(121.94,60.7)
  Bottom Layer w0.254: 27.12,109.3 10.45,109.3 8.07,106.92 U10.1 ; 27.12,109.3 U11.1 ; 27.12,109.3 46.17,109.3 ; 103.35,109.3 103.32,109.27 103.32,106.19 ; 103.35,109.3 84.26,109.3 ; 103.35,109.3 122.37,109.3 ; 65.22,109.3 46.17,109.3 ; 65.22,109.3 65.22,106.19 ; 65.22,109.3 84.26,109.3 ; 46.17,109.3 U12.1 ; 84.26,109.3 84.27,109.29 U14.1 ; 122.4,109.43 127.4,104.44 127.4,98.91 103.37,74.88 103.37,61.16 107,57.53 121.06,57.53 122.42,58.88 122.42,60.22 v2(121.94,60.7)
ROW2: length 167
  Top Layer w0.254: U1.13 v2(121.94,63.24)
  Bottom Layer w0.254: U21.1 27.12,90.25 ; 27.12,90.25 10.45,90.25 8.07,87.87 U20.1 ; 27.12,90.25 46.17,90.25 ; 65.22,87.14 65.22,90.25 ; 65.22,90.25 84.27,90.25 ; 65.22,90.25 46.17,90.25 ; 84.27,90.25 U24.1 ; 84.27,90.25 98.92,90.25 102.38,86.78 102.38,60.11 105.99,56.51 121.06,56.51 122.95,58.4 122.95,62.22 v2(121.94,63.24) ; U22.1 46.17,90.25
ROW3: length 153.5
  Top Layer w0.254: U1.14 v2(121.94,64.51)
  Bottom Layer w0.254: U31.1 27.12,71.2 ; 27.12,71.2 46.17,71.2 ; 27.12,71.2 8.07,71.2 5.69,68.82 5.69,68.09 ; 46.17,71.2 U32.1 ; 46.17,71.2 65.22,71.2 ; U33.1 65.22,71.2 ; 65.22,71.2 84.27,71.2 ; 84.27,71.2 96.33,71.2 101.59,65.94 101.59,59.38 105.48,55.49 121.32,55.49 123.97,58.14 123.97,62.61 122.06,64.51 v2(121.94,64.51) ; 84.27,71.2 U34.1
ROW4: length 110.2
  Top Layer w0.254: U1.15 v2(121.94,65.78)
  Bottom Layer w0.254: 65.22,49.03 65.22,52.15 ; 65.22,52.15 39.02,52.15 36.64,49.76 U42.1 ; 65.22,52.15 84.27,52.15 ; U44.1 84.27,52.15 ; 84.27,52.15 119.24,52.15 124.98,57.89 124.98,62.86 122.06,65.78 v2(121.94,65.78)
RST: length 2.3
  Top Layer w0.254: 110.53,61.97 v2(108.22,61.97)
SCL1: length 31.6
  Top Layer w0.254: U1.3 v2(112.54,69.59)
  Bottom Layer w0.254: v2(112.54,69.59) 128.47,69.59 130.29,67.77 130.29,60.65 132.53,58.41 U46.7
SDA1: length 23.7
  Top Layer w0.254: U1.4 v2(112.54,68.32)
  Bottom Layer w0.254: 130.33,58.92 122.76,66.5 114.36,66.5 v2(112.54,68.32)
$1N69: length 7.8
  Bottom Layer w0.254: SW00.3 8.07,114.54 8.07,121.2
$1N70: length 8.5
  Bottom Layer w0.254: U01.2 27.12,114.54 SW01.3
$1N71: length 8.5
  Bottom Layer w0.254: U02.2 46.17,114.54 SW02.3
$1N72: length 8.5
  Bottom Layer w0.254: SW03.3 65.22,114.54 U03.2
$1N73: length 8.5
  Bottom Layer w0.254: U04.2 84.27,114.54 SW04.3
$1N74: length 8.5
  Bottom Layer w0.254: U05.2 108.08,114.6 SW05.3
$1N77: length 8.5
  Bottom Layer w0.254: U10.2 8.07,95.49 SW10.3
$1N78: length 8.5
  Bottom Layer w0.254: U11.2 27.12,95.49 SW11.3
$1N79: length 8.5
  Bottom Layer w0.254: SW12.3 46.17,95.49 U12.2
$1N80: length 8.5
  Bottom Layer w0.254: U13.2 65.22,95.49 SW13.3
$1N81: length 8.5
  Bottom Layer w0.254: U14.2 84.27,95.49 SW14.3
$1N82: length 8.5
  Bottom Layer w0.254: U15.2 103.32,95.48 SW15.3
$1N83: length 8.5
  Bottom Layer w0.254: U20.2 8.07,76.44 SW20.3
$1N84: length 8.5
  Bottom Layer w0.254: SW21.3 27.12,76.44 U21.2
$1N85: length 8.5
  Bottom Layer w0.254: SW22.3 46.17,76.44 U22.2
$1N86: length 8.5
  Bottom Layer w0.254: U23.2 65.22,76.44 SW23.3
$1N87: length 8.5
  Bottom Layer w0.254: U24.2 84.27,76.44 SW24.3
$1N90: length 19
  Bottom Layer w0.254: U30.2 5.69,52.15 8.07,49.77 8.07,47.86 SW30.3
$1N91: length 8.5
  Bottom Layer w0.254: U31.2 27.12,57.39 SW31.3
$1N92: length 8.5
  Bottom Layer w0.254: U32.2 46.17,57.39 SW32.3
$1N95: length 8.5
  Bottom Layer w0.254: SW33.3 65.22,57.39 U33.2
$1N97: length 8.5
  Bottom Layer w0.254: U34.2 84.27,57.39 SW34.3
$1N99: length 8.5
  Bottom Layer w0.254: SW42.3 36.64,38.34 U42.2
$1N100: length 8.5
  Bottom Layer w0.254: SW43.3 65.22,38.34 U43.2
$1N101: length 8.5
  Bottom Layer w0.254: U44.2 84.27,38.34 SW44.3
$1N102: length 23.5
  Bottom Layer w0.254: 46.71,48.59 49.72,48.59 51.5,46.81 69.44,46.81
$1N103: length 13.9
  Bottom Layer w0.254: SW43.2 78.3,48.59 80.08,46.81 88.49,46.81
$1N108: length 153.3
  Bottom Layer w0.254: 94.33,67.64 97.35,67.64 100.94,64.05 100.94,56.91 98.56,54.53 39.02,54.53 34.26,49.76 34.26,35.48 39.02,30.71 50.93,30.71 55.69,35.48 55.69,42.62 53.31,45 39.02,45 38.64,45.39 38.64,46.37 39.09,46.81 40.87,46.81
$1N109: length 13.9
  Bottom Layer w0.254: SW33.2 78.3,67.64 80.08,65.86 SW34.6
$1N110: length 13.9
  Bottom Layer w0.254: 56.23,67.64 59.25,67.64 61.03,65.86 SW33.6
$1N111: length 13.9
  Bottom Layer w0.254: SW32.6 41.98,65.86 40.2,67.64 37.18,67.64
$1N112: length 18.9
  Bottom Layer w0.254: SW31.6 24.23,65.86 22.36,63.99 22.36,59.67 20.8,58.12 SW30.2
$1N113: length 193.8
  Bottom Layer w0.254: SW30.6 10.38,56.34 9.94,55.89 9.94,55.04 10.45,54.53 22.36,54.53 27.12,49.76 27.12,45 22.36,40.24 10.45,40.24 3.31,47.38 3.31,69.96 5.75,72.4 99.76,72.4 100.94,73.58 100.94,80.09 94.33,86.69
$1N114: length 13.9
  Bottom Layer w0.254: 88.49,84.91 80.08,84.91 78.3,86.69 75.28,86.69
$1N115: length 13.9
  Bottom Layer w0.254: 69.44,84.91 61.03,84.91 59.25,86.69 56.23,86.69
$1N116: length 13.9
  Bottom Layer w0.254: 37.18,86.69 40.2,86.69 41.98,84.91 50.39,84.91
$1N117: length 13.9
  Bottom Layer w0.254: 31.34,84.91 22.93,84.91 21.15,86.69 18.13,86.69
$1N118: length 196.9
  Bottom Layer w0.254: 113.38,105.74 118.78,105.74 119.99,104.54 119.99,92.63 118.81,91.45 5.88,91.45 4.35,89.93 4.35,74.91 5.69,73.58 22.36,73.58 24.74,75.96 24.74,80.72 22.36,83.1 10.45,83.1 9.94,83.61 9.94,84.47 10.38,84.91 12.29,84.91
$1N119: length 13.9
  Bottom Layer w0.254: 94.33,105.74 97.35,105.74 99.13,103.96 SW15.6
$1N120: length 13.9
  Bottom Layer w0.254: SW14.6 80.08,103.96 78.3,105.74 75.28,105.74
$1N121: length 13.9
  Bottom Layer w0.254: SW13.6 61.03,103.96 59.25,105.74 56.23,105.74
$1N122: length 13.9
  Bottom Layer w0.254: SW12.6 41.98,103.96 40.2,105.74 37.18,105.74
$1N123: length 13.9
  Bottom Layer w0.254: 18.13,105.74 21.15,105.74 22.93,103.96 SW11.6
$1N125: length 18.8
  Bottom Layer w0.254: SW04.2 97.35,124.79 99.13,123.01 SW05.6
$1N126: length 13.9
  Bottom Layer w0.254: SW03.2 78.3,124.79 80.08,123.01 SW04.6
$1N127: length 13.9
  Bottom Layer w0.254: SW03.6 61.03,123.01 59.25,124.79 SW02.2
$1N128: length 13.9
  Bottom Layer w0.254: SW02.6 41.98,123.01 40.2,124.79 SW01.2
$1N129: length 13.9
  Bottom Layer w0.254: SW00.2 21.15,124.79 22.93,123.01 SW01.6
$1N130: length 201.3
  Bottom Layer w0.254: SW05.2 119.41,123.58 124.75,123.58 127.13,121.2 127.13,114.06 124.75,111.68 10.45,111.68 4.35,105.58 4.35,93.96 5.69,92.63 22.36,92.63 24.74,95.01 24.74,99.77 22.36,102.15 10.54,102.15 10.07,102.63 10.07,103.52 10.51,103.96 SW10.6

## Copper pours and planes (outline as drawn; the poured copper is in the pictures)
GND on Top Layer: -30.49,161.49 236.21,161.49 236.21,-31.55 -30.49,-31.55
GND on Bottom Layer: -17.54,143.2 207.51,143.2 207.51,-6.66 -17.54,-6.66

Small or netless copper shapes (teardrops, artwork), in the pictures only: 5 on Top Layer, 20 on Bottom Layer

## Text on the board
Top Silkscreen Layer: MPU9250 | PB19 | PB21 | PB23 | PB1 | PB3 | PB5 | PB7 | PB18 | PB11 | PB20 | PB13 | PB22 | PB15 | PB0 | GND | PB2 | PB4 | PB6 | PB10 | PB12 | PB14 | VCC | 3V3 | 5V | PA5 | PA0 | PA2 | PA15 | PA14 | PA11 | NFC_CTR | PA9 | PA4 | PA7 | PA6 | LED0 | PA1 | PA3 | LED1 | PA13 | PA12 | PA10 | PA8 | PB9 | PB8 | PB17 | PB16 | Download | H2 | H1 | WCH_Link | RXD | H3 | TXD | Debug | RX | UART1 | SDK | SCL | NCS | TX
